# Altium project RpiBaseBoard.PrjPcb
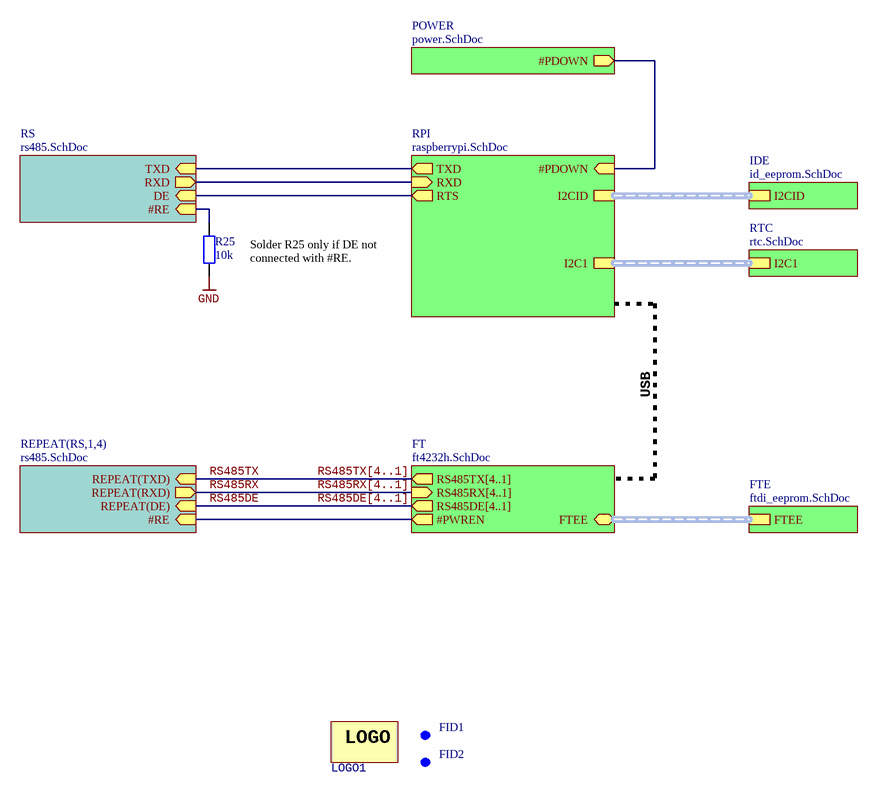
[diagram p0: top_level.SchDoc]
id: RpiRs485Hat; ver: 1.0
8 sheets, 134 parts. Net scope: hierarchical (ports join the sheet entries above them; power ports are global).
Board file: RpiBaseBoard.PcbDoc
Sheets:
  top_level.SchDoc
    RPI = raspberrypi.SchDoc
    RS = rs485.SchDoc
    FT = ft4232h.SchDoc
    RS1 = rs485.SchDoc
    RS2 = rs485.SchDoc
    RS3 = rs485.SchDoc
    RS4 = rs485.SchDoc
    IDE = id_eeprom.SchDoc
    RTC = rtc.SchDoc
    FTE = ftdi_eeprom.SchDoc
    POWER = power.SchDoc

## Sheet top_level.SchDoc: Test
size A4; DrawnBy: Łukasz Przeniosło; Organization: Zachodniopomorski; Address1: Uniwersytet Technologiczny; Address2: w Szczecinie; Address3: Wydział Elektryczny; DocumentNumber: 1; Revision: 1.0; SheetNumber: 1; SheetTotal: 8

### Parts
FID1  Fiducial  [Fid Round]  (value not drawn)  (no BOM)
FID2  Fiducial  [Fid Round]  (value not drawn)  (no BOM)
LOGO1  Logo  [LOGO_BEMKO]  (value not drawn)
R25  10k  [RESC1005N]

### Sub-sheets
FT = ft4232h.SchDoc: RS485TX[4..1] (out), RS485RX[4..1] (in), #PWREN (out), FTEE (harness FTEE), RS485DE[4..1] (out)
FTE = ftdi_eeprom.SchDoc: FTEE (harness FTEE)
IDE = id_eeprom.SchDoc: I2CID (harness I2CID)
POWER = power.SchDoc: #PDOWN (out)
REPEAT(RS,1,4) = rs485.SchDoc: REPEAT(TXD) (in), REPEAT(RXD) (out), REPEAT(DE) (in), #RE (in)
RPI = raspberrypi.SchDoc: I2CID (harness I2CID), I2C1 (harness I2C1), TXD (out), RXD (in), RTS (out), #PDOWN (in)
RS = rs485.SchDoc: TXD (in), RXD (out), DE (in), #RE (in)
RTC = rtc.SchDoc: I2C1 (harness I2C1)

### Nets
GND: R25.1
#PDOWN: sheet RPI/#PDOWN, sheet POWER/#PDOWN
#PWREN: sheet FT/#PWREN, sheet REPEAT(RS,1,4)/#RE
#RE: R25.2 ; sheet RS/#RE
DE: sheet RPI/RTS, sheet RS/DE
RS485DE: sheet REPEAT(RS,1,4)/REPEAT(DE)
RS485RX: sheet REPEAT(RS,1,4)/REPEAT(RXD)
RS485TX: sheet REPEAT(RS,1,4)/REPEAT(TXD)
RXD0: sheet RPI/RXD, sheet RS/RXD
TXD0: sheet RPI/TXD, sheet RS/TXD

### Buses and harness runs
bus RS485DE[4..1] = sheet FT/RS485DE[4..1]
bus RS485RX[4..1] = sheet FT/RS485RX[4..1]
bus RS485TX[4..1] = sheet FT/RS485TX[4..1]
harness sheet FT/FTEE = sheet FTE/FTEE
harness sheet IDE/I2CID = sheet RPI/I2CID
harness sheet RPI/I2C1 = sheet RTC/I2C1

### Notes on the sheet
- (near R25) Solder R25 only if DE not connected with #RE.
- USB
- Title
- Size:
- Date:
- A4
- Author:
- Time:
- Sheet
- of
- File:
- (in symbol Logo) LOGO

### Library data of the parts
FID1 FID2 = FID ROUND: round fiducial
R25 = Resistor: Power: 0W; Tolerance: 1%; Value: 10k

## Sheet raspberrypi.SchDoc: Test
size A4; DrawnBy: Łukasz Przeniosło; Organization: Zachodniopomorski; Address1: Uniwersytet Technologiczny; Address2: w Szczecinie; Address3: Wydział Elektryczny; DocumentNumber: 2; Revision: 1.0; SheetNumber: 2; SheetTotal: 8
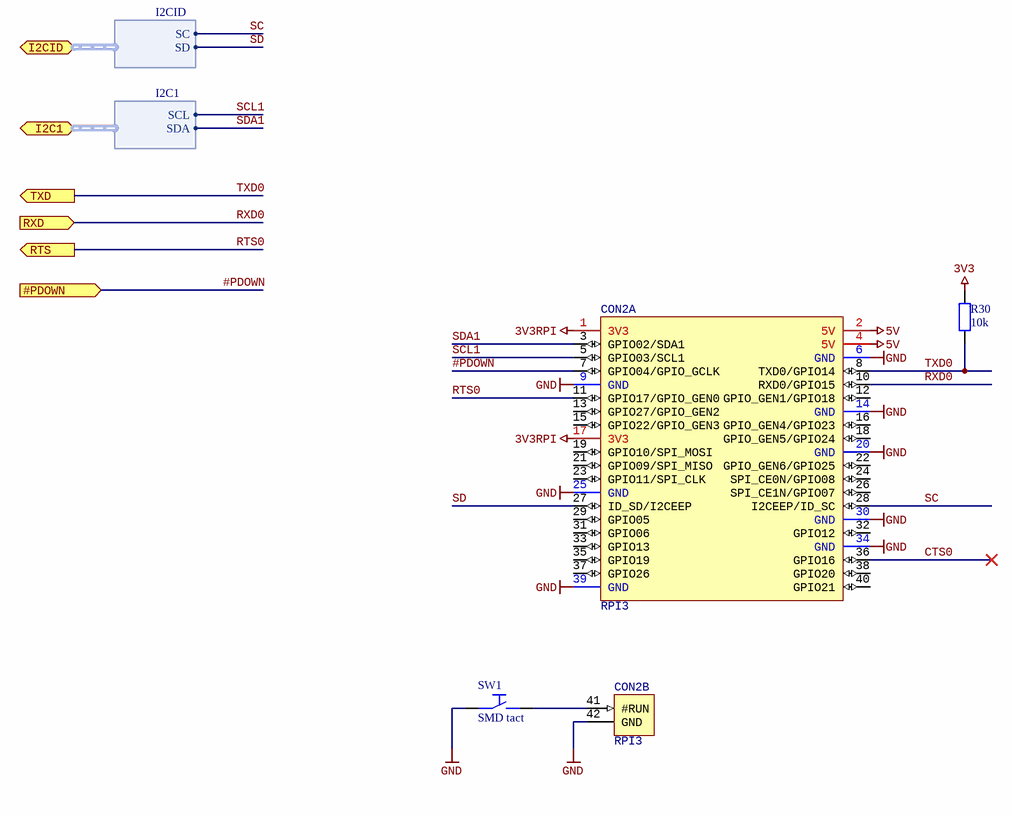
[diagram p1: raspberrypi.SchDoc]

### Parts
CON2  RPI3  [RaspberryPi3]  (parts A,B of 2)
R30  10k  [RESC1608N]
SW1  SMD tact  [ULTRA-SMALL-TACT-SWITCH-SMT]

### Ports
#PDOWN (in), I2C1 (harness I2C1), I2CID (harness I2CID), RTS (out), RXD (in), TXD (out)

### Harnesses
I2CID: SC, SD
I2C1: SCL, SDA

### Nets
3V3: R30.1
3V3RPI: CON2.1(3V3) CON2.17(3V3)
5V: CON2.2(5V) CON2.4(5V)
GND: CON2.6(GND) CON2.9(GND) CON2.14(GND) CON2.20(GND) CON2.25(GND) CON2.30(GND) CON2.34(GND) CON2.39(GND) CON2.42(GND) SW1.1
#PDOWN: CON2.7(GPIO04/GPIO_GCLK) ; port #PDOWN
CTS0: CON2.36(GPIO16)
RTS0: CON2.11(GPIO17/GPIO_GEN0) ; port RTS  [project net DE]
RXD0: CON2.10(RXD0/GPIO15) ; port RXD
SC: CON2.28(I2CEEP/ID_SC) ; port I2CID.SC
SCL1: CON2.5(GPIO03/SCL1) ; port I2C1.SCL
SD: CON2.27(ID_SD/I2CEEP) ; port I2CID.SD
SDA1: CON2.3(GPIO02/SDA1) ; port I2C1.SDA
TXD0: CON2.8(TXD0/GPIO14) R30.2 ; port TXD
NetCON2_41: CON2.41(#RUN) SW1.2

Not connected (* = marked no-connect by the designer): CON2 12(GPIO_GEN1/GPIO18) 13(GPIO27/GPIO_GEN2) 15(GPIO22/GPIO_GEN3) 16(GPIO_GEN4/GPIO23) 18(GPIO_GEN5/GPIO24) 19(GPIO10/SPI_MOSI) 21(GPIO09/SPI_MISO) 22(GPIO_GEN6/GPIO25) 23(GPIO11/SPI_CLK) 24(SPI_CE0N/GPIO08) 26(SPI_CE1N/GPIO07) 29(GPIO05) 31(GPIO06) 32(GPIO12) 33(GPIO13) 35(GPIO19) 37(GPIO26) 38(GPIO20) 40(GPIO21)

### Notes on the sheet
- Title
- Size:
- Date:
- A4
- Author:
- Time:
- Sheet
- of
- File:

### Library data of the parts
CON2 = RaspberryPi3: Raspberry pi model 3B connector with step
R30 = Resistor: Tolerance: 1%; Power: 0W; Value: 10k
SW1 = DTSHW66NB: SWITCH, SPNO TACT; Published: 8-Jun-2000; LatestRevisionDate: 17-Jul-2002; LatestRevisionNote: Re-released for DXP Platform.; PackageDocument: Sep-1998; PackageReference: SOT-23A; Publisher: Altium Limited; ComponentLink1Description: Manufacturer Link; ComponentLink2Description: Datasheet; Distributor: tme.pl; tme.pl: DTSHW66NB

## Sheet rs485.SchDoc: Test
size A4; DrawnBy: Łukasz Przeniosło; Organization: Zachodniopomorski; Address1: Uniwersytet Technologiczny; Address2: w Szczecinie; Address3: Wydział Elektryczny; DocumentNumber: 6; Revision: 1.0; SheetNumber: 6; SheetTotal: 8
Used 5 times, as channels RS, RS1, RS2, RS3, RS4. Parts and nets are listed once, with the designators drawn on the sheet.
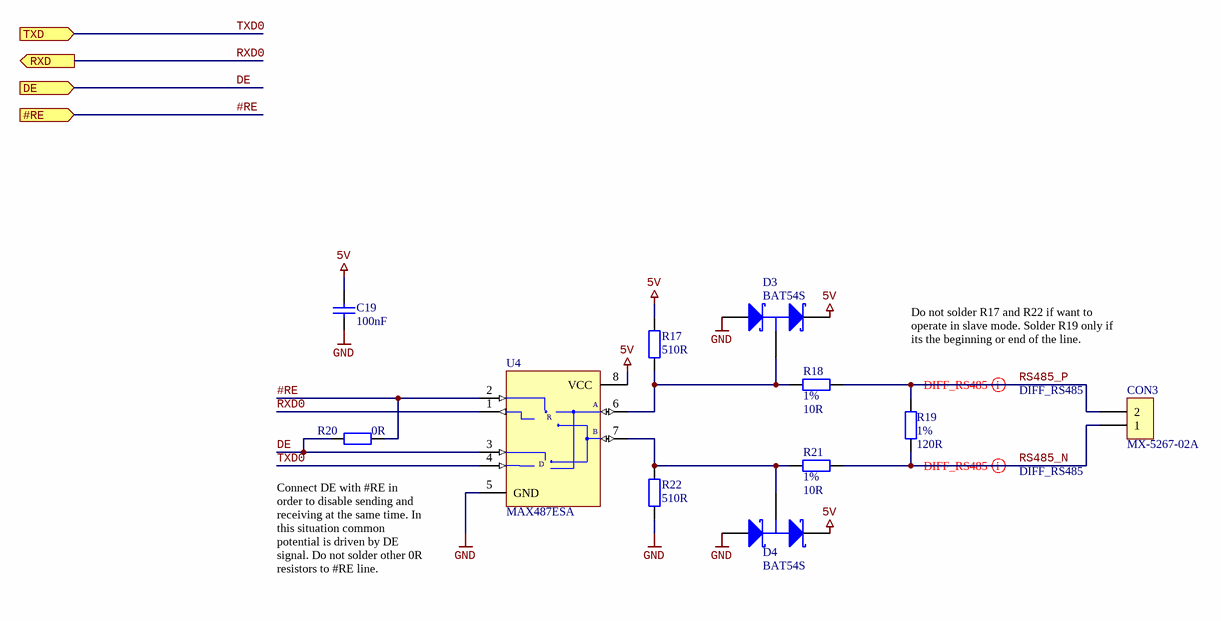
[diagram p2: rs485.SchDoc]

### Parts
C19  100nF  [CAPC1608N]
CON3  MX-5267-02A  [MX-5267-02A]
D3  BAT54S  [SOT23-3L]
D4  BAT54S  [SOT23-3L]
R17  510R  [RESC1608N]
R18  Tolerance: 1%  [RESC2012N]  (hidden comment: 10R)
R19  Tolerance: 1%  [RESC3216N]  (hidden comment: 120R)
R20  0R  [RESC1005N]
R21  Tolerance: 1%  [RESC2012N]  (hidden comment: 10R)
R22  510R  [RESC1608N]
U4  MAX487ESA  [SO-8_L]

### Ports
#RE (in), DE (in), RXD (out), TXD (in)

### Nets
5V: C19.1 D3.2(K) D4.2(K) R17.2 U4.8(VCC)
GND: C19.2 D3.1(A) D4.1(A) R22.1 U4.5(GND)
#RE: R20.2 U4.2(~{RE}) ; port #RE
DE: R20.1 U4.3(DE) ; port DE
RS485_N: CON3.1 R19.2 R21.1
RS485_P: CON3.2 R18.1 R19.1
RXD0: U4.1(RO) ; port RXD
TXD0: U4.4(DI) ; port TXD
NetD3_3: D3.3(C) R17.1 R18.2 U4.6(A)
NetD4_3: D4.3(C) R21.2 R22.2 U4.7(B)

### Channels
RS: designators end in RS; ports #RE=#RE DE=DE RXD=RXD0 TXD=TXD0
RS1: designators end in RS1; ports #RE=#PWREN DE=RS485DE1 RXD=RS485RX1 TXD=RS485TX1
RS2: designators end in RS2; ports #RE=#PWREN DE=RS485DE2 RXD=RS485RX2 TXD=RS485TX2
RS3: designators end in RS3; ports #RE=#PWREN DE=RS485DE3 RXD=RS485RX3 TXD=RS485TX3
RS4: designators end in RS4; ports #RE=#PWREN DE=RS485DE4 RXD=RS485RX4 TXD=RS485TX4

### Layout directives
differential pair; net class DIFF_RS485: RS485_N_RS, RS485_P_RS

### Notes on the sheet
- Do not solder R17 and R22 if want to operate in slave mode. Solder R19 only if its the beginning or end of the line.
- (near R20) Connect DE with #RE in order to disable sending and receiving at the same time. In this situation common potential is driven by DE signal. Do not solder other 0R resistors to #RE line.
- Title
- Size:
- Date:
- A4
- Author:
- Time:
- Sheet
- of
- File:
- (in symbol MAX487ESA) R; D

### Library data of the parts
C19 = Capacitor: Value: 100nF
CON3 = MX-02227-2021: Pith 2.54mm, 2-pin; ComponentLink1Description: Manufacturer Link; ComponentLink2Description: Datasheet; Distributor: tme.pl; tme.pl: MX-6410-03A
D3 D4 = BAT54S: Schottky Barrier Double Diode; Published: 17-Sep-2003; DatasheetVersion: 4-Mar-2002; PackageVersion: May-1999; PackageReference: SOT23; Publisher: Altium Limited; PackageDescription: 3-Pin SOT-23 Package 0.95 mm Pitch, 2.3 mm Lead Span; ComponentLink1Description: Manufacturer Link; ComponentLink1URL: http://www.semiconductors.philips.com/; ComponentLink2Description: Datasheet; ComponentLink2URL: http://www.semiconductors.philips.com/acrobat/datasheets/BAT54_SERIES_4.pdf; LatestRevisionDate: 12-Dec-2006; LatestRevisionNote: IPC-7351 Footprint Added.
R17 R22 = Resistor: Tolerance: 5%; Power: 0W; Value: 510R
R18 R19 R21 = Resistor: Power: 0W
  R18 R21: Value: 10R
  R19: Value: 120R
R20 = Resistor: Power: 0W; Tolerance: 1%; Value: 0R
U4 = MAX487ESA: Low-Power, Slew-Rate-Limited RS-485/RS-422 Transceiver; Published: 16-Jan-2001; LatestRevisionDate: 13-Apr-2006; LatestRevisionNote: IPC-7351 Footprint Added.; DatasheetVersion: Feb-1996; PackageReference: NSO8; Publisher: Altium Limited; PackageDescription: 8-Pin Small Outline Integrated Circuit 1.27 mm Pitch; Code_JEDEC: MS-012-AA; Code_IPC: SOIC127P600-8; ComponentLink1Description: Manufacturer Link; ComponentLink1URL: http://www.maxim-ic.com/; ComponentLink2Description: Datasheet; ComponentLink2URL: http://pdfserv.maxim-ic.com/en/ds/MAX1487-MAX491.pdf

## Sheet ft4232h.SchDoc: Test
size A4; DrawnBy: Łukasz Przeniosło; Organization: Zachodniopomorski; Address1: Uniwersytet Technologiczny; Address2: w Szczecinie; Address3: Wydział Elektryczny; DocumentNumber: 4; Revision: 1.0; SheetNumber: 4; SheetTotal: 8
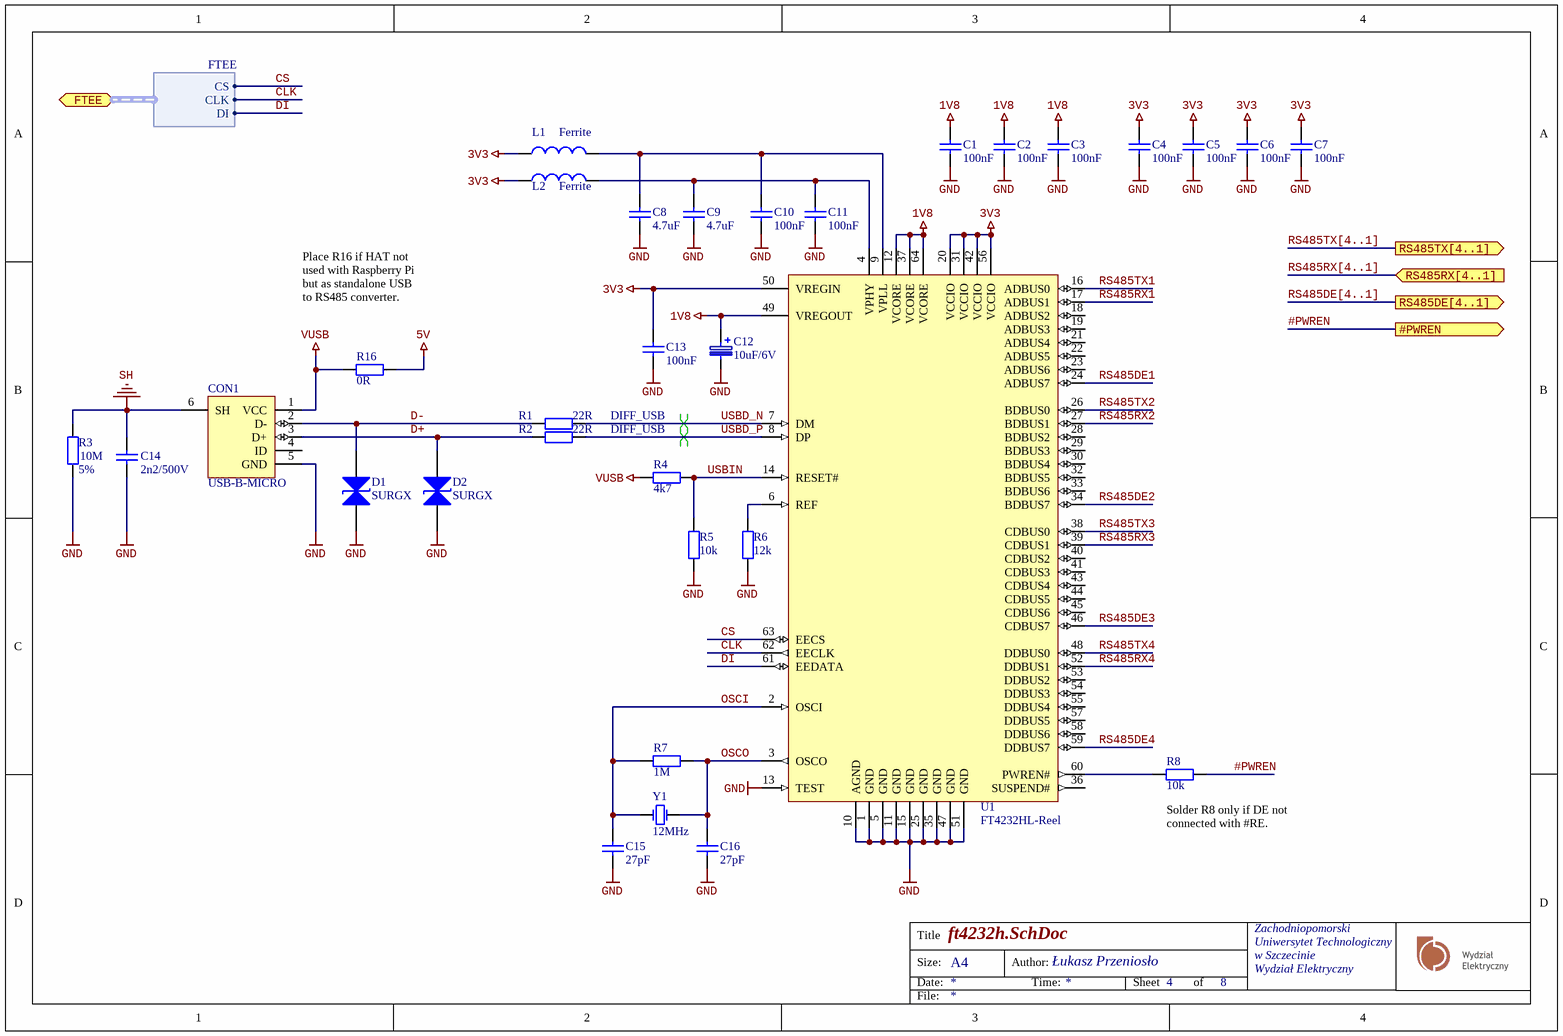
[diagram p3: ft4232h.SchDoc]

### Parts
C1  100nF  [CAPC1608N]
C2  100nF  [CAPC1608N]
C3  100nF  [CAPC1608N]
C4  100nF  [CAPC1608N]
C5  100nF  [CAPC1608N]
C6  100nF  [CAPC1608N]
C7  100nF  [CAPC1608N]
C8  4.7uF  [CAPC1608N]
C9  4.7uF  [CAPC1608N]
C10  100nF  [CAPC1608N]
C11  100nF  [CAPC1608N]
C12  10uF/6V  [SMDA]
C13  100nF  [CAPC1608N]
C14  2n2/500V  [CAPC3216N]
C15  27pF  [CAPC1608N]
C16  27pF  [CAPC1608N]
CON1  USB-B-MICRO  [MICRO-USB-CONNECTOR]
D1  SURGX  [SURGX-0603]
D2  SURGX  [SURGX-0603]
L1  Ferrite  [inductor_0603]
L2  Ferrite  [inductor_0603]
R1  22R  [RESC1608N]
R2  22R  [RESC1608N]
R3  Tolerance: 5%  [RESC3216N]  (hidden comment: 10M)
R4  4k7  [RESC1608N]
R5  10k  [RESC1608N]
R6  12k  [RESC1608N]
R7  1M  [RESC1608N]
R8  10k  [RESC1608N]
R16  0R  [RESC2012N]
U1  FT4232HL-Reel  [LQFP-64_L]
Y1  12MHz  [HC49/4H_SMX]

### Ports
#PWREN (out), FTEE (harness FTEE), RS485DE[4..1] (out), RS485RX[4..1] (in), RS485TX[4..1] (out)

### Harnesses
FTEE: CS, CLK, DI

### Nets
1V8: C1.1 C2.1 C3.1 C12.1 U1.12(VCORE) U1.37(VCORE) U1.49(VREGOUT) U1.64(VCORE)
3V3: C4.1 C5.1 C6.1 C7.1 C13.1 L1.1 L2.1 U1.20(VCCIO) U1.31(VCCIO) U1.42(VCCIO) U1.50(VREGIN) U1.56(VCCIO)
5V: R16.1
GND: C1.2 C2.2 C3.2 C4.2 C5.2 C6.2 C7.2 C8.2 C9.2 C10.2 C11.2 C12.2 C13.2 C14.1 C15.1 C16.1 CON1.5(GND) D1.1 D2.1 R3.1 R5.2 R6.2 U1.1(GND) U1.5(GND) U1.10(AGND) U1.11(GND) U1.13(TEST) U1.15(GND) U1.25(GND) U1.35(GND) U1.47(GND) U1.51(GND)
SH: C14.2 CON1.6(SH) R3.2
VUSB: CON1.1(VCC) R4.1 R16.2
#PWREN: R8.1 ; port #PWREN
CLK: U1.62(EECLK) ; port FTEE.CLK
CS: U1.63(EECS) ; port FTEE.CS
D+: CON1.3(D+) D2.2 R2.1
D-: CON1.2(D-) D1.2 R1.1
DI: U1.61(EEDATA) ; port FTEE.DI
OSCI: C15.2 R7.2 U1.2(OSCI) Y1.1(OSC1)
OSCO: C16.2 R7.1 U1.3(OSCO) Y1.2(OSC2)
RS485DE1: U1.24(ADBUS7)
RS485DE2: U1.34(BDBUS7)
RS485DE3: U1.46(CDBUS7)
RS485DE4: U1.59(DDBUS7)
RS485RX1: U1.17(ADBUS1)
RS485RX2: U1.27(BDBUS1)
RS485RX3: U1.39(CDBUS1)
RS485RX4: U1.52(DDBUS1)
RS485TX1: U1.16(ADBUS0)
RS485TX2: U1.26(BDBUS0)
RS485TX3: U1.38(CDBUS0)
RS485TX4: U1.48(DDBUS0)
USBD_N: R1.2 U1.7(DM)
USBD_P: R2.2 U1.8(DP)
USBIN: R4.2 R5.1 U1.14(RESET#)
NetC8_1: C8.1 C10.1 L1.2 U1.9(VPLL)
NetC9_1: C9.1 C11.1 L2.2 U1.4(VPHY)
NetR6_1: R6.1 U1.6(REF)
NetR8_2: R8.2 U1.60(PWREN#)

Not connected (* = marked no-connect by the designer): CON1 4(ID); U1 18(ADBUS2) 19(ADBUS3) 21(ADBUS4) 22(ADBUS5) 23(ADBUS6) 28(BDBUS2) 29(BDBUS3) 30(BDBUS4) 32(BDBUS5) 33(BDBUS6) 36(SUSPEND#) 40(CDBUS2) 41(CDBUS3) 43(CDBUS4) 44(CDBUS5) 45(CDBUS6) 53(DDBUS2) 54(DDBUS3) 55(DDBUS4) 57(DDBUS5) 58(DDBUS6)

### Buses and harness runs
bus RS485DE[4..1] = port RS485DE[4..1]
bus RS485RX[4..1] = port RS485RX[4..1]
bus RS485TX[4..1] = port RS485TX[4..1]

### Layout directives
differential pair; net class DIFF_USB: USBD_N, USBD_P

### Notes on the sheet
- Place R16 if HAT not used with Raspberry Pi but as standalone USB to RS485 converter.
- (near R8) Solder R8 only if DE not connected with #RE.
- Title
- Size:
- Date:
- A4
- Author:
- Time:
- Sheet
- of
- File:

### Library data of the parts
C1-C11 C13-C16 = Capacitor
  C1-C7 C10 C11 C13: Value: 100nF
  C8 C9: Value: 4.7uF
  C14: Value: 2n2/500V
  C15 C16: Value: 27pF
C12 = 100uF 6.3V-SMDB: Polarized Capacitor (Surface Mount); Value: 10uF; PackageReference: SMDB; Manufacturer: *; Manufacturer Part No.: *; Distributor: tme.pl; Distributor Order Code: TC 100/6.3-SMDB; tme.pl: TC 100/6.3-SMDA; farnell: 1135048
CON1 = USB-B-MICRO-Sock
D1 D2 = SURGX: ESD Suppressor; ComponentLink1Description: Manufacturer Link; ComponentLink2Description: Datasheet; Distributor: tme.pl
L1 L2 = Inductor: Code_IEC: 1005; Value: 10mH; Published: 8-Jun-2000; LatestRevisionDate: 29-May-2009; LatestRevisionNote: IPC-7351 Footprint Added.; PackageReference: 0402-A; Publisher: Altium Limited; PackageDescription: Chip Inductor; Code_JEITA: 0402
R1 R2 R16 = Resistor: Tolerance: 5%; Power: 0W
  R1 R2: Value: 22R
  R16: Value: 0R
R3 = Resistor: Power: 0W; Value: 10M
R4-R6 = Resistor: Tolerance: 1%; Power: 0W
  R4: Value: 4k7
  R5: Value: 10k
  R6: Value: 12k
R7 R8 = Resistor: Power: 0W; Tolerance: 5%
  R7: Value: 1M
  R8: Value: 10k
U1 = COM-UART-FT4232H-LQFP64: Quad High Speed USB To Multipurpose UART/MPSSE IC, 64-pin LQFP, Tape and Reel; Manufacturer: FTDI; PackageDescription: 64-Pin Thin Quad Flat Pack, 10 x 10 x 1.4 mm Body, 0.5 mm Pitch; DatasheetVersion: ver 2.2, Jan-2012; ComponentLink2URL: http://www.ftdichip.com/Support/Documents/DataSheets/ICs/DS_FT4232H.pdf; ComponentLink1Description: Manufacturer URL; PackageReference: LQFP-64; PackageVersion: Jan-12; RevisionNote: DatasheetVersion updated to 2.2 Jan-2012; PartNumber: FT4232HL-Reel; ComponentLink1URL: http://www.ftdichip.com/; ComponentLink2Description: Datasheet
Y1 = HC49: Value: 12MHz

## Sheet id_eeprom.SchDoc: Test
size A4; DrawnBy: Łukasz Przeniosło; Organization: Zachodniopomorski; Address1: Uniwersytet Technologiczny; Address2: w Szczecinie; Address3: Wydział Elektryczny; DocumentNumber: 3; Revision: 1.0; SheetNumber: 3; SheetTotal: 8
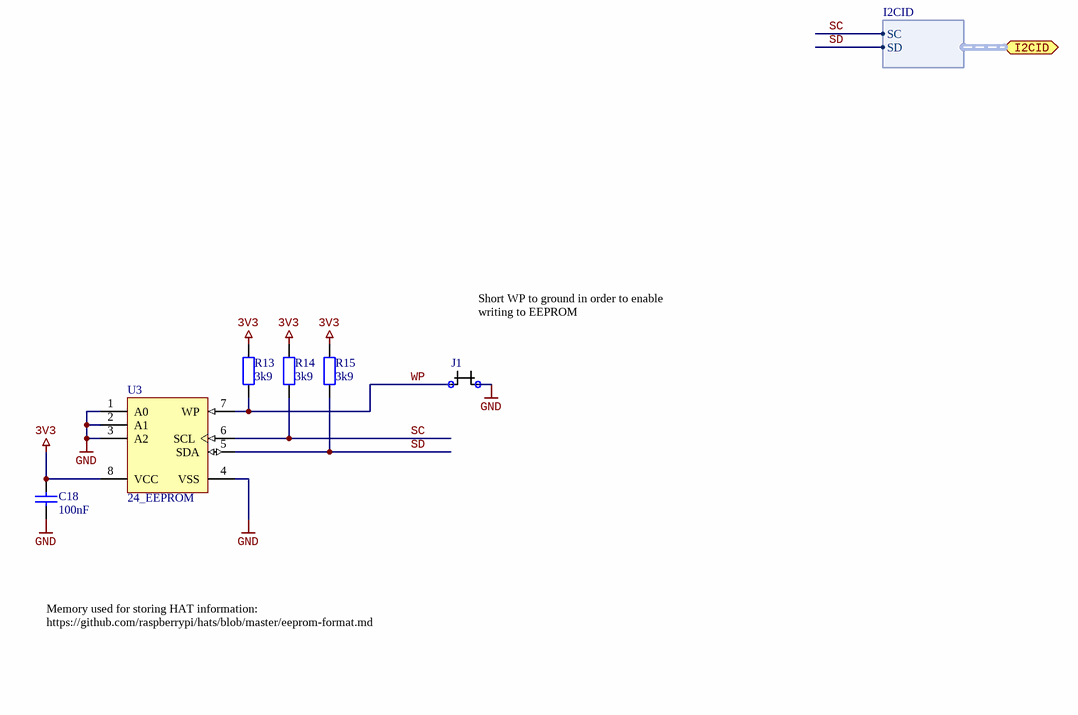
[diagram p4: id_eeprom.SchDoc]

### Parts
C18  100nF  [CAPC1608N]
J1  Jumper  [JUMPER]  (value not drawn)
R13  3k9  [RESC1608N]
R14  3k9  [RESC1608N]
R15  3k9  [RESC1608N]
U3  24_EEPROM  [SO-8_L]

### Ports
I2CID (harness I2CID)

### Harnesses
I2CID: SC, SD

### Nets
3V3: C18.2 R13.1 R14.1 R15.1 U3.8(VCC)
GND: C18.1 J1.2 U3.1(A0) U3.2(A1) U3.3(A2) U3.4(VSS)
SC: R14.2 U3.6(SCL) ; port I2CID.SC
SD: R15.2 U3.5(SDA) ; port I2CID.SD
WP: J1.1 R13.2 U3.7(WP)

### Notes on the sheet
- (near J1) Short WP to ground in order to enable writing to EEPROM
- Memory used for storing HAT information:
  https://github.com/raspberrypi/hats/blob/master/eeprom-format.md
- Title
- Size:
- Date:
- A4
- Author:
- Time:
- Sheet
- of
- File:

### Library data of the parts
C18 = Capacitor: Value: 100nF
R13-R15 = Resistor: Tolerance: 5%; Power: 0W; Value: 3k9
U3 = 24_EEPROM: 16Kbit, 400kHz, 2.5V, I2C Serial EEPROM, 8-Pin SOIC 150mil, Extended Temperature; DatasheetVersion: revA, Nov-2008; Code_JEDEC: MS-012; PackageDescription: 8-Lead Plastic Small Outline (SN) - Narrow, 3.90mm Body [SOIC]; Code_IPC: SOIC127P600-8; PackageReference: SOIC-SN8; PackageVersion: revBB, Aug-2009

## Sheet rtc.SchDoc: Test
size A4; DrawnBy: Łukasz Przeniosło; Organization: Zachodniopomorski; Address1: Uniwersytet Technologiczny; Address2: w Szczecinie; Address3: Wydział Elektryczny; DocumentNumber: 5; Revision: 1.0; SheetNumber: 5; SheetTotal: 8
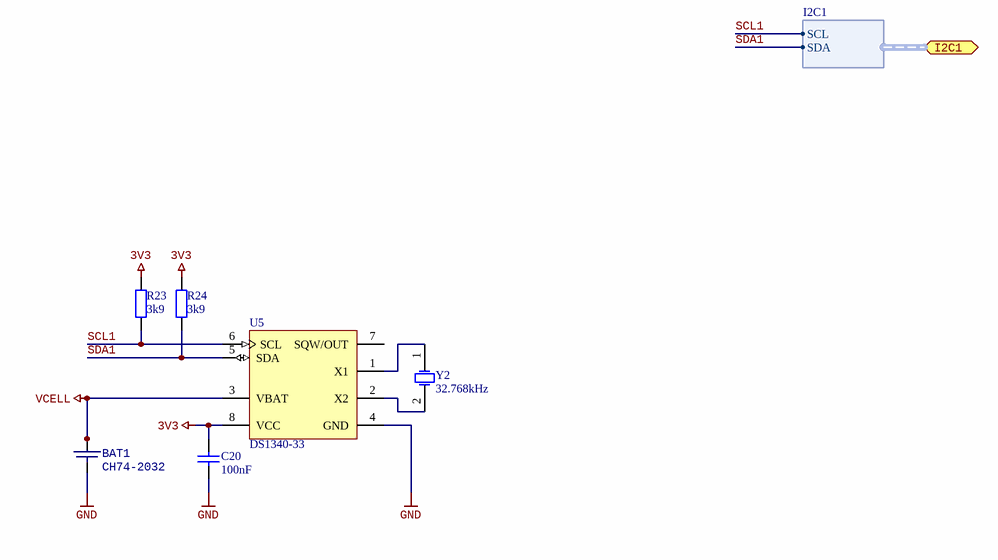
[diagram p5: rtc.SchDoc]

### Parts
BAT1  CH74-2032  [BAT_2032_HOLDER]
C20  100nF  [CAPC1608N]
R23  3k9  [RESC1608N]
R24  3k9  [RESC1608N]
U5  DS1340-33  [SO-8_L]
Y2  32.768kHz  [ABS25-crystal]

### Ports
I2C1 (harness I2C1)

### Harnesses
I2C1: SCL, SDA

### Nets
3V3: C20.2 R23.1 R24.1 U5.8(VCC)
GND: BAT1.3(BAT-) C20.1 U5.4(GND)
VCELL: BAT1.1(BAT+) BAT1.2(BAT+) U5.3(VBAT)
SCL1: R23.2 U5.6(SCL) ; port I2C1.SCL
SDA1: R24.2 U5.5(SDA) ; port I2C1.SDA
NetU5_1: U5.1(X1) Y2.1(OSC1)
NetU5_2: U5.2(X2) Y2.2(OSC2)

Not connected (* = marked no-connect by the designer): U5 7(SQW/OUT)

### Notes on the sheet
- Title
- Size:
- Date:
- A4
- Author:
- Time:
- Sheet
- of
- File:

### Library data of the parts
C20 = Capacitor: Value: 100nF
R23 R24 = Resistor: Tolerance: 5%; Power: 0W; Value: 3k9
U5 = CMP-0254-00324-1: 64 x 8, Serial, I2C Real-Time Clock, 5.0V, 8-Pin SO, -40 to 85 degC, Pb-Free; PackageDescription: 8-Pin Small-Outline IC, Narrow (0.15in), 1.27 mm Pitch, SOIC (N), Pb-Free; PackageVersion: revC, 2010; ComponentLink3URL: http://pdfserv.maxim-ic.com/package_dwgs/21-0041.PDF; Code_IPC: SOIC127P600-8; Code_JEDEC: MS-012-AA; ComponentLink2Description: Datasheet; ComponentLink3Description: Package Specification; PackageReference: S8+2; DatasheetVersion: 10-Feb-2008; ComponentLink2URL: http://datasheets.maxim-ic.com/en/ds/DS1307.pdf; ComponentLink1Description: Manufacturer URL; ComponentLink1URL: http://www.maxim-ic.com
Y2 = XTAL: Crystal Oscillator; Value: 32.768kHz

## Sheet ftdi_eeprom.SchDoc: Test
size A4; DrawnBy: Łukasz Przeniosło; Organization: Zachodniopomorski; Address1: Uniwersytet Technologiczny; Address2: w Szczecinie; Address3: Wydział Elektryczny; DocumentNumber: 7; Revision: 1.0; SheetNumber: 7; SheetTotal: 8
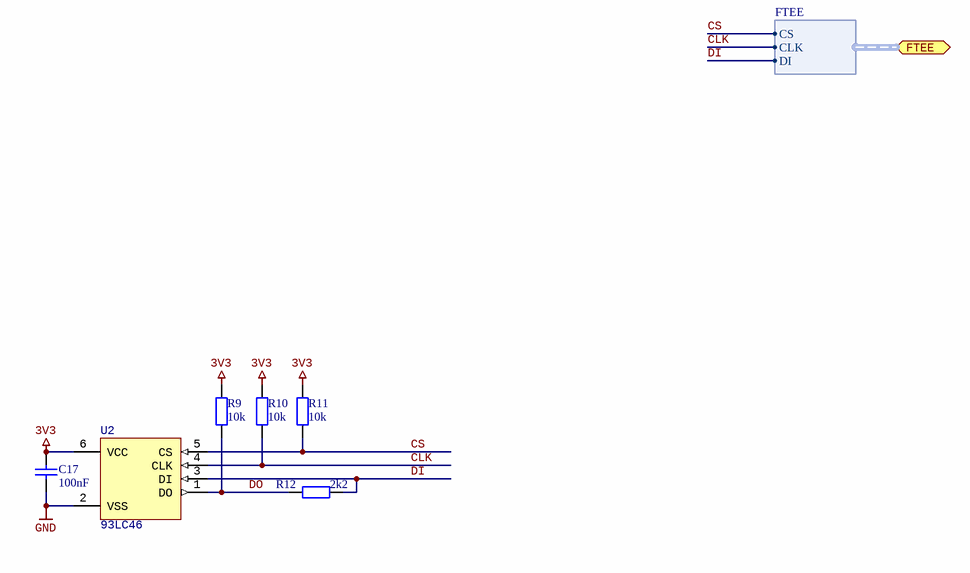
[diagram p6: ftdi_eeprom.SchDoc]

### Parts
C17  100nF  [CAPC1608N]
R9  10k  [RESC1608N]
R10  10k  [RESC1608N]
R11  10k  [RESC1608N]
R12  2k2  [RESC1608N]
U2  93LC46  [SOT23-6]

### Ports
FTEE (harness FTEE)

### Harnesses
FTEE: CS, CLK, DI

### Nets
3V3: C17.2 R9.1 R10.1 R11.1 U2.6(VCC)
GND: C17.1 U2.2(VSS)
CLK: R10.2 U2.4(CLK) ; port FTEE.CLK
CS: R11.2 U2.5(CS) ; port FTEE.CS
DI: R12.2 U2.3(DI) ; port FTEE.DI
DO: R9.2 R12.1 U2.1(DO)

### Notes on the sheet
- Title
- Size:
- Date:
- A4
- Author:
- Time:
- Sheet
- of
- File:

### Library data of the parts
C17 = Capacitor: Value: 100nF
R9-R12 = Resistor: Tolerance: 1%; Power: 0W
  R9-R11: Value: 10k
  R12: Value: 2k2
U2 = 93LC46: 1K Microwire Compatible Serial EEPROM

## Sheet power.SchDoc: Test
size A4; DrawnBy: Łukasz Przeniosło; Organization: Zachodniopomorski; Address1: Uniwersytet Technologiczny; Address2: w Szczecinie; Address3: Wydział Elektryczny; DocumentNumber: 8; Revision: 1.0; SheetNumber: 8; SheetTotal: 8
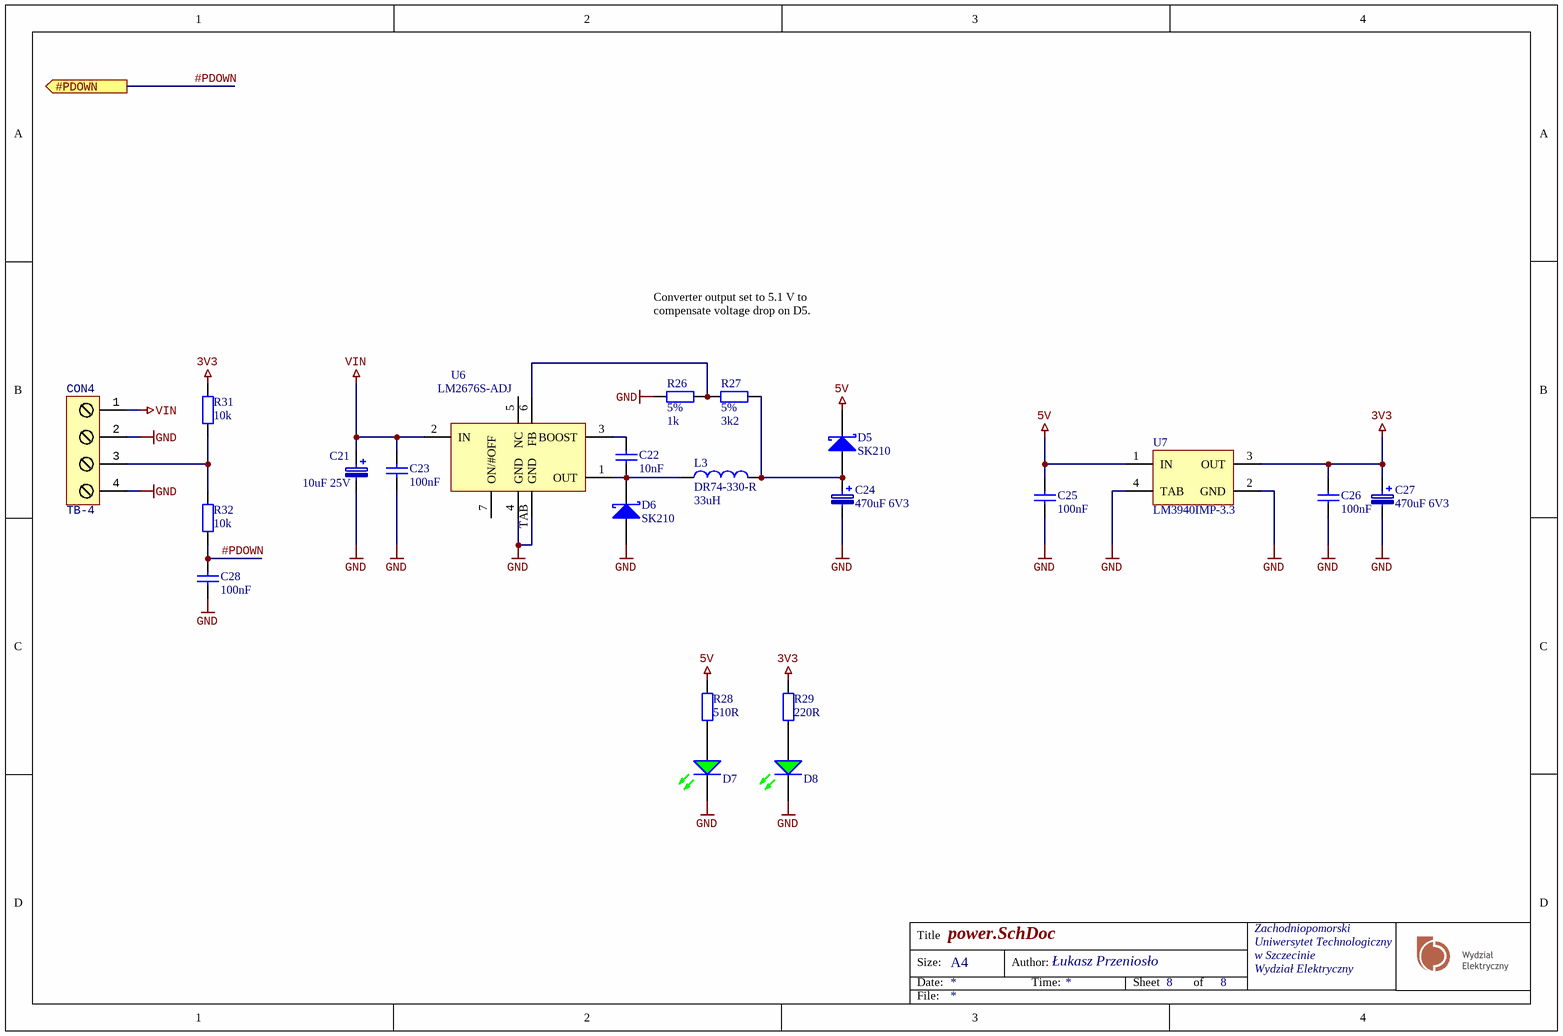
[diagram p7: power.SchDoc]

### Parts
C21  10uF 25V  [SMDB]
C22  10nF  [CAPC1608N]
C23  100nF  [CAPC1608N]
C24  470uF 6V3  [SMDD]
C25  100nF  [CAPC1608N]
C26  100nF  [CAPC1608N]
C27  470uF 6V3  [SMDD]
C28  100nF  [CAPC1608N]
CON4  TB-4  [Terminal-block-4way-2.54]
D5  SK210  [SMB]
D6  SK210  [SMB]
D7  LL-S172GC-2A  [CD2012-0805]  (value not drawn)
D8  LL-S172GC-2A  [CD2012-0805]  (value not drawn)
L3  DR74-330-R  value 33uH  [DR74 Series]
R26  Tolerance: 5%  [RESC1608N]  (hidden comment: 1k)
R27  Tolerance: 5%  [RESC1608N]  (hidden comment: 3k2)
R28  510R  [RESC1608N]
R29  220R  [RESC1608N]
R31  10k  [RESC1608N]
R32  10k  [RESC1608N]
U6  LM2676S-ADJ  [TO-263-7]
U7  LM3940IMP-3.3  [MP04A_N]

### Ports
#PDOWN (out)

### Nets
3V3: C26.2 C27.1 R29.1 R31.1 U7.3(OUT)
5V: C25.2 D5.2(K) R28.1 U7.1(IN)
GND: C21.2 C23.1 C24.2 C25.1 C26.1 C27.2 C28.1 CON4.2 CON4.4 D6.1(A) D7.2(K) D8.2(K) R26.1 U6.4(GND) U6.TAB(GND) U7.2(GND) U7.4(TAB)
VIN: C21.1 C23.2 CON4.1 U6.2(IN)
#PDOWN: C28.2 R32.2 ; port #PDOWN
NetC22_1: C22.1 D6.2(K) L3.1 U6.1(OUT)
NetC22_2: C22.2 U6.3(BOOST)
NetC24_1: C24.1 D5.1(A) L3.2 R27.2
NetCON4_3: CON4.3 R31.2 R32.1
NetD7_1: D7.1(A) R28.2
NetD8_1: D8.1(A) R29.2
NetR26_2: R26.2 R27.1 U6.6(FB)

Not connected (* = marked no-connect by the designer): U6 5(NC) 7(ON/#OFF)

### Notes on the sheet
- Converter output set to 5.1 V to compensate voltage drop on D5.
- Title
- Size:
- Date:
- A4
- Author:
- Time:
- Sheet
- of
- File:

### Library data of the parts
C21 = Capacitor Tantalum: Value: 10uF 25V
C22 C23 C28 = Capacitor
  C22: Value: 10nF
  C23 C28: Value: 100nF
C24 C27 = 10uF 35V-SMDD: Polarized Capacitor (Surface Mount); Value: 10uF; PackageReference: SMDD; Manufacturer: *; Manufacturer Part No.: *; Distributor: tme.pl; Distributor Order Code: TC 10/35-SMDD; tme.pl: TC 10/35-SMDD
C25 C26 = Cap: Capacitor; Published: 8-Jun-2000; LatestRevisionDate: 17-Jul-2002; LatestRevisionNote: Re-released for DXP Platform.; Publisher: Altium Limited
CON4 = Terminal Block 4
D5 D6 = MBRS340T3: Schottky Barrier Rectifier,  40V, 3A; PackageReference: SMC; Distributor: *; Distributor Order Code: *; Manufacturer Part No.: *; tme.pl: MBRS340T3
D7 D8 = Led Green: Typical GREEN LED; Manufacturer: Lucky Light; Value: LL-S172GC-2A
L3 = DR74-330-R: elfa.se: 58-101-14; Published: 8-Jun-2000; PackageDocument: Sep-1998; Publisher: Altium Limited; ComponentLink1Description: Manufacturer Link; ComponentLink2Description: Datasheet; Distributor: tme.pl
R26 R27 = Resistor: Power: 0W
  R26: Value: 1k
  R27: Value: 3k2
R28 R29 R31 R32 = Resistor: Tolerance: 5%; Power: 0W
  R28: Value: 510R
  R29: Value: 220R
  R31 R32: Value: 10k
U6 = LM2676S-ADJ: SIMPLE SWITCHER High Efficiency 3A Step-Down Voltage Regulator; elfa.se: 73-068-81; ComponentLink1Description: Manufacturer Link; ComponentLink1URL: http://www.national.com/; ComponentLink2Description: Datasheet; ComponentLink2URL: http://www.national.com/ds.cgi/LM/LM2676.pdf; Distributor: tme.pl
U7 = LM3940IMP-3.3: 1A Low Dropout Regulator for 5V to 3.3V Conversion, 4-pin SOT-223; Manufacturer: National Semiconductor; PackageTopMarking: XYTT*L52B; PowerWise: N; CompType: LDO IC; Published: 4-Dec-2008; DatasheetVersion: Jul-2007; PackageVersion: revB, Apr-2003; PackageReference: MP04A; Publisher: Altium Limited; PackageDescription: Molded SOT-223, 6.50 x 3.56 x 1.6mm Body, 4 Lead, 2.3mm Pitch; Supplier 1: Farnell; Supplier Part Number 1: 9779280; PartNumber: LM3940IMP-3.3; RoHS: N; PinCount: 4; Code_JEDEC: TO-261-AA; Code_IPC: SOT223-4; ComponentLink1Description: LM3940 Datasheet; ComponentLink1URL: http://www.national.com/ds/LM/LM3940.pdf; ComponentLink2Description: LM3940 Web Page; ComponentLink2URL: http://www.national.com/pf/LM/LM3940.html; ComponentLink3Description: MP04A Package Page; ComponentLink3URL: http://www.national.com/packaging/folders/mp04a.html

## Nets that join several sheets
3V3: raspberrypi (R30.1), ft4232h (12 pins), id_eeprom (5 pins), rtc (C20.2 R23.1 R24.1 U5.8), ftdi_eeprom (5 pins), power (5 pins)
5V: raspberrypi (CON2.2 CON2.4), RS (5 pins), ft4232h (R16.1), RS1 (5 pins), RS2 (5 pins), RS3 (5 pins), RS4 (5 pins), power (C25.2 D5.2 R28.1 U7.1)
GND: top_level (R25.1), raspberrypi (10 pins), RS (5 pins), ft4232h (32 pins), RS1 (5 pins), RS2 (5 pins), RS3 (5 pins), RS4 (5 pins), id_eeprom (6 pins), rtc (BAT1.3 C20.1 U5.4), ftdi_eeprom (C17.1 U2.2), power (17 pins)
#PDOWN: raspberrypi (CON2.7), power (C28.2 R32.2)
#PWREN: ft4232h (R8.1), RS1 (R20RS1.2 U4RS1.2), RS2 (R20RS2.2 U4RS2.2), RS3 (R20RS3.2 U4RS3.2), RS4 (R20RS4.2 U4RS4.2)
#RE: top_level (R25.2), RS (R20RS.2 U4RS.2)
CLK: ft4232h (U1.62), ftdi_eeprom (R10.2 U2.4)
CS: ft4232h (U1.63), ftdi_eeprom (R11.2 U2.5)
DE: raspberrypi (CON2.11), RS (R20RS.1 U4RS.3)
DI: ft4232h (U1.61), ftdi_eeprom (R12.2 U2.3)
RS485DE1: ft4232h (U1.24), RS1 (R20RS1.1 U4RS1.3)
RS485DE2: ft4232h (U1.34), RS2 (R20RS2.1 U4RS2.3)
RS485DE3: ft4232h (U1.46), RS3 (R20RS3.1 U4RS3.3)
RS485DE4: ft4232h (U1.59), RS4 (R20RS4.1 U4RS4.3)
RS485RX1: ft4232h (U1.17), RS1 (U4RS1.1)
RS485RX2: ft4232h (U1.27), RS2 (U4RS2.1)
RS485RX3: ft4232h (U1.39), RS3 (U4RS3.1)
RS485RX4: ft4232h (U1.52), RS4 (U4RS4.1)
RS485TX1: ft4232h (U1.16), RS1 (U4RS1.4)
RS485TX2: ft4232h (U1.26), RS2 (U4RS2.4)
RS485TX3: ft4232h (U1.38), RS3 (U4RS3.4)
RS485TX4: ft4232h (U1.48), RS4 (U4RS4.4)
RXD0: raspberrypi (CON2.10), RS (U4RS.1)
SC: raspberrypi (CON2.28), id_eeprom (R14.2 U3.6)
SCL1: raspberrypi (CON2.5), rtc (R23.2 U5.6)
SD: raspberrypi (CON2.27), id_eeprom (R15.2 U3.5)
SDA1: raspberrypi (CON2.3), rtc (R24.2 U5.5)
TXD0: raspberrypi (CON2.8 R30.2), RS (U4RS.4)